# Altium schematic sheet SRAM.SchDoc
size A4; SheetNumber: 3; SheetTotal: 7
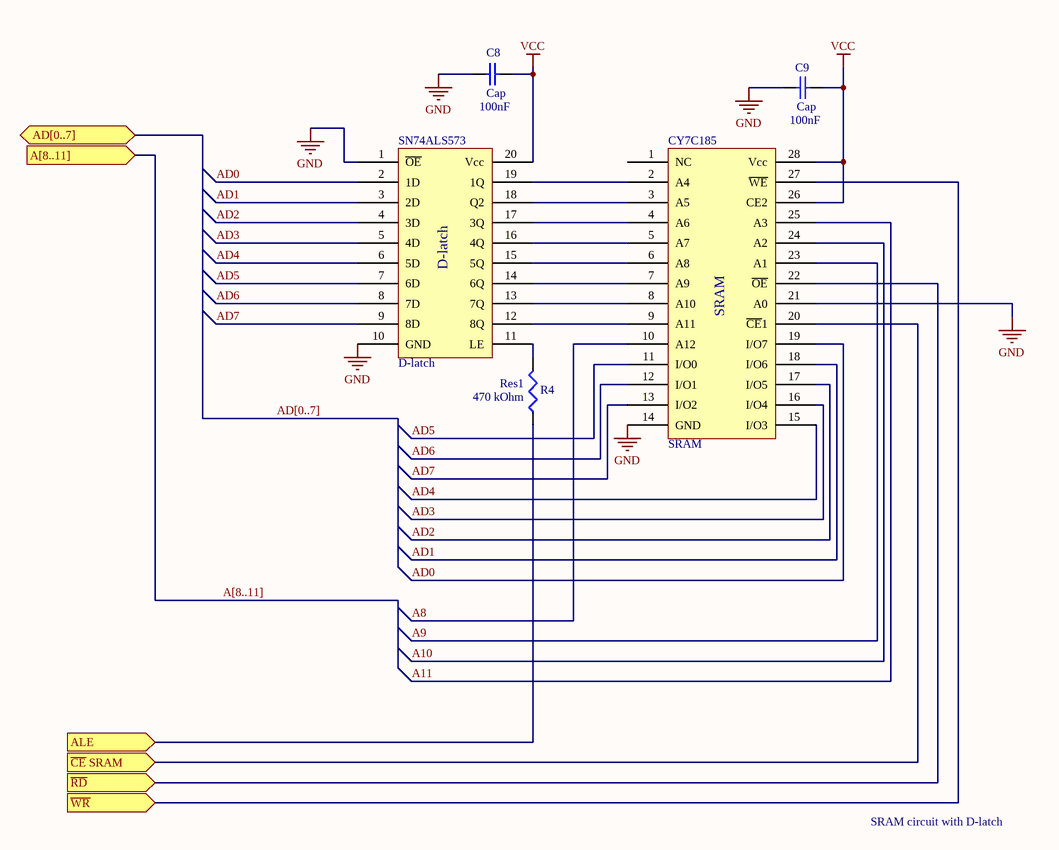
[diagram p0: SRAM.SchDoc]

## Parts
C8  Cap  value 100nF  [C1210]
C9  Cap  value 100nF  [C1210]
CY7C185  SRAM  [CY7C185 SOIC 28-PIN]
R4  Res1  value 470 kOhm  [14-1210]
SN74ALS573  D-latch  [D-Latch SOIC 20-PIN]

## Ports
A[8..11] (in), AD[0..7] (bidir), ALE (in), ~{CE} SRAM (in), ~{RD} (in), ~{WR} (in)

## Nets
GND: C8.2 C9.2 CY7C185.14(GND) CY7C185.21(A0) SN74ALS573.1(~{OE}) SN74ALS573.10(GND)
VCC: C8.1 C9.1 CY7C185.26(CE2) CY7C185.28(Vcc) SN74ALS573.20(Vcc)
A8: CY7C185.10(A12)
A9: CY7C185.23(A1)
A10: CY7C185.24(A2)
A11: CY7C185.25(A3)
AD0: CY7C185.19(I/O7) SN74ALS573.2(1D)
AD1: CY7C185.18(I/O6) SN74ALS573.3(2D)
AD2: CY7C185.17(I/O5) SN74ALS573.4(3D)
AD3: CY7C185.16(I/O4) SN74ALS573.5(4D)
AD4: CY7C185.15(I/O3) SN74ALS573.6(5D)
AD5: CY7C185.11(I/O0) SN74ALS573.7(6D)
AD6: CY7C185.12(I/O1) SN74ALS573.8(7D)
AD7: CY7C185.13(I/O2) SN74ALS573.9(8D)
ALE: R4.2 ; port ALE
~{CE} SRAM: CY7C185.20(~{CE}1) ; port ~{CE} SRAM
~{RD}: CY7C185.22(~{OE}) ; port ~{RD}
~{WR}: CY7C185.27(~{WE}) ; port ~{WR}
NetCY7C185_2: CY7C185.2(A4) SN74ALS573.19(1Q)
NetCY7C185_3: CY7C185.3(A5) SN74ALS573.18(Q2)
NetCY7C185_4: CY7C185.4(A6) SN74ALS573.17(3Q)
NetCY7C185_5: CY7C185.5(A7) SN74ALS573.16(4Q)
NetCY7C185_6: CY7C185.6(A8) SN74ALS573.15(5Q)
NetCY7C185_7: CY7C185.7(A9) SN74ALS573.14(6Q)
NetCY7C185_8: CY7C185.8(A10) SN74ALS573.13(7Q)
NetCY7C185_9: CY7C185.9(A11) SN74ALS573.12(8Q)
NetR4_1: R4.1 SN74ALS573.11(LE)

Not connected (* = marked no-connect by the designer): CY7C185 1(NC)

## Buses and harness runs
bus A[8..11] = port A[8..11]
bus AD[0..7] = port AD[0..7]

## Notes on the sheet
- SRAM circuit with D-latch
- Title:
- Course:
- TTK4155 Industrielle og innbygde datasystemers kontruksjon
- Size:
- Date:
- Author:
- A4
- Moltumyr, Andreas Hanssen
- Number:
- Time:
- Revision:
- Sheet
- of
- File:

## Library data of the parts
C8 C9 = Cap Semi: Capacitor (Semiconductor SIM Model); Published: 8-Jun-2000; LatestRevisionDate: 29-May-2009; LatestRevisionNote: IPC-7351 Footprint Added.; PackageReference: C1206; Publisher: Altium Limited; PackageDescription: Chip Capacitor
CY7C185 = CY7C185: SRAM - Static Random Access Memory
R4 = Res3: Resistor; Published: 8-Jun-2000; LatestRevisionDate: 29-May-2009; LatestRevisionNote: IPC-7351 Footprint Added.; PackageReference: J1-0603; Publisher: Altium Limited; PackageDescription: Chip Resistor
SN74ALS573 = SN74ALS573